# Altium schematic sheet Mis - Coin Battery CR2032.SchDoc
size Letter
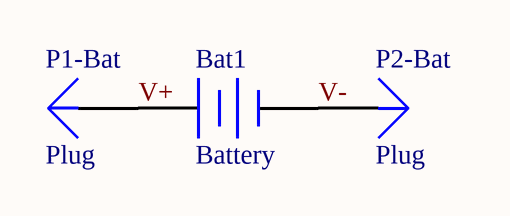
[diagram p0: Mis - Coin Battery CR2032.SchDoc]

## Parts
Bat1  Battery  [CR2032 Coin Holder]
P1-Bat  Plug  [PIN1]
P2-Bat  Plug  [PIN1]

## Nets
V+: Bat1.1(+) P1-Bat.1
V-: Bat1.2(-) P2-Bat.1

## Library data of the parts
Bat1 = Battery: Multicell Battery; Published: 24-Mar-1999; LatestRevisionDate: 17-Jul-2002; LatestRevisionNote: Re-released for DXP Platform.; PackageReference: BAT-2; Publisher: Altium Limited; PackageDescription: Battery; 2 Leads
P1-Bat P2-Bat = Plug: LatestRevisionDate: 17-Jul-2002; LatestRevisionNote: Re-released for DXP Platform.; Publisher: Altium Limited